# EAGLE design sx-wdec-smd-4313 (EAGLE 7.7.0)
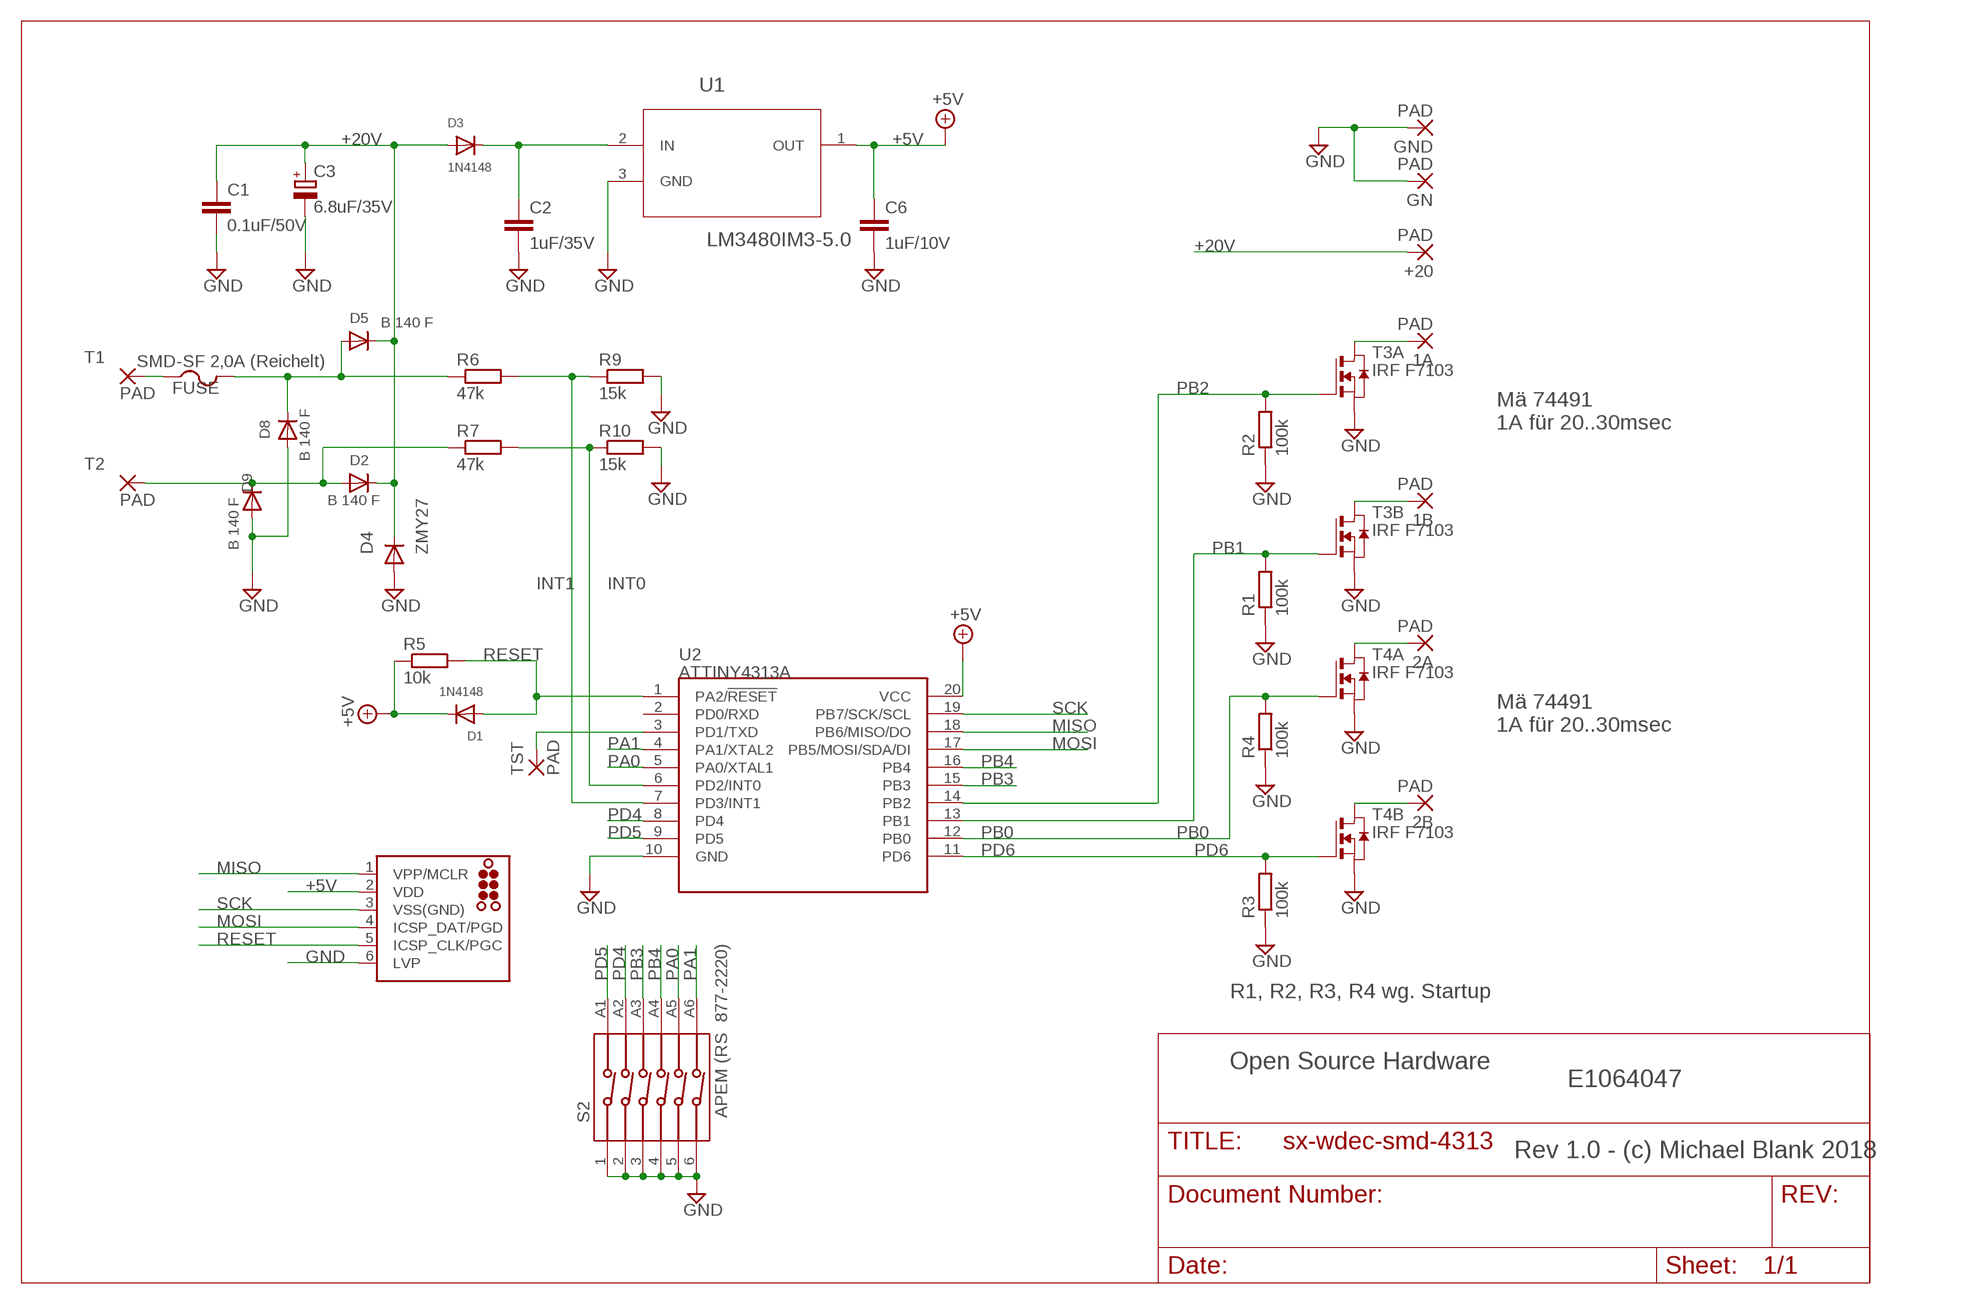
[diagram p0: schematic, sheet 1]

## Parts
1A  PAD  SMD2  [SMD1,27-2,54]
1B  PAD  SMD2  [SMD1,27-2,54]
2A  PAD  SMD2  [SMD1,27-2,54]
2B  PAD  SMD2  [SMD1,27-2,54]
+20  PAD  SMD2  [SMD1,27-2,54]
C1  0.1uF/50V  C-EUC0805  [C0805]
C2  1uF/35V  C-EUC0805  [C0805]
C3  6.8uF/35V  CPOL-EUSMCD  [SMC_D]
C6  1uF/10V  C-EUC0805  [C0805]
D1  1N4148  DIODESOD-323F  [SOD-323F]
D2  B 140 F  DIODESMA-403D  [SMA-403D]
D3  1N4148  DIODESOD-323F  [SOD-323F]
D4  ZMY27  DIODE-MELF-MLL41  [MELF-MLL41]
D5  B 140 F  DIODESMA-403D  [SMA-403D]
D8  B 140 F  DIODESMA-403D  [SMA-403D]
D9  B 140 F  DIODESMA-403D  [SMA-403D]
FUSE  SMD-SF 2,0A (Reichelt)  PTCFUSE-1812  [1812]
GN  PAD  SMD2  [SMD1,27-2,54]
GND  PAD  SMD2  [SMD1,27-2,54]
J1  ISP  TC2030-MCP-NL  [TC2030-MCP-NL]
R1  100k  R-EU_R0805W  [R0805W]
R2  100k  R-EU_R0805W  [R0805W]
R3  100k  R-EU_R0805W  [R0805W]
R4  100k  R-EU_R0805W  [R0805W]
R5  10k  R-EU_R0805W  [R0805W]
R6  47k  R-EU_R0805W  [R0805W]
R7  47k  R-EU_R0805W  [R0805W]
R9  15k  R-EU_R0805W  [R0805W]
R10  15k  R-EU_R0805W  [R0805W]
S2  APEM (RS 877-2220)  416131160806  [416131160806]
T1  PAD  SMD2  [SMD1,27-2,54]
T2  PAD  SMD2  [SMD1,27-2,54]
T3  IRF F7103  DMN3024LSD  [SO8]
T4  IRF F7103  DMN3024LSD  [SO8]
TST  PAD  SMD2  [SMD1,27-2,54]
U1  LM3480IM3-5.0  [SOT95P263X110-3N]
U2  ATTINY4313A  ATTINY2313A  [SOP20W]

## Nets
+5V: C6.1 D1.C J1.2(VDD) R5.1 U1.1(OUT) U2.20(VCC)
+20V: +20.1(P) C1.1 C3.+ D2.C D3.A D4.C D5.C
GND: C1.2 C2.2 C3.- C6.2 D4.A D8.A D9.A GN.1(P) GND.1(P) J1.6(LVP) R1.1 R2.1 R3.1 R4.1 R9.2 R10.2 S2.1 S2.2 S2.3 S2.4 S2.5 S2.6 T3.1(A:S) T3.3(B:S) T4.1(A:S) T4.3(B:S) U1.3(GND) U2.10(GND)
INT0: R7.2 R10.1 U2.6(PD2/INT0)
INT1: R6.2 R9.1 U2.7(PD3/INT1)
MISO: J1.1(VPP/MCLR) U2.18(PB6/MISO/DO)
MOSI: J1.4(ICSP_DAT/PGD) U2.17(PB5/MOSI/SDA/DI)
N$1: 2B.1(P) T4.5(B:D) T4.6(B:D)
N$2: 2A.1(P) T4.7(A:D) T4.8(A:D)
N$3: FUSE.1 T1.1(P)
N$5: D5.A D8.C FUSE.2 R6.1
N$6: TST.1(P) U2.3(PD1/TXD)
N$7: C2.1 D3.C U1.2(IN)
N$8: 1B.1(P) T3.5(B:D) T3.6(B:D)
N$10: 1A.1(P) T3.7(A:D) T3.8(A:D)
PA0: S2.A5 U2.5(PA0/XTAL1)
PA1: S2.A6 U2.4(PA1/XTAL2)
PB0: R4.2 T4.2(A:G) U2.12(PB0)
PB1: R1.2 T3.4(B:G) U2.13(PB1)
PB2: R2.2 T3.2(A:G) U2.14(PB2)
PB3: S2.A3 U2.15(PB3)
PB4: S2.A4 U2.16(PB4)
PD4: S2.A2 U2.8(PD4)
PD5: S2.A1 U2.9(PD5)
PD6: R3.2 T4.4(B:G) U2.11(PD6)
RESET: D1.A J1.5(ICSP_CLK/PGC) R5.2 U2.1(PA2/!RESET)
SCK: J1.3(VSS(GND)) U2.19(PB7/SCK/SCL)
TR-L: D2.A D9.C R7.1 T2.1(P)
Unconnected: U2.2(PD0/RXD)

## Notes on the sheet
- Mä 74491
  1A für 20..30msec
- Mä 74491
  1A für 20..30msec
- R1, R2, R3, R4 wg. Startup
- Open Source Hardware
- E1064047
- Rev 1.0 - (c) Michael Blank 2018

## Library data of the parts
1A 1B 2A 2B +20 GN GND T1 T2 TST = wirepad:SMD2: SMD PAD
C1 C2 C6 = rcl:C-EU: CAPACITOR, European symbol
C3 = resistor:CPOL-EU: POLARIZED CAPACITOR, European symbol
D1 D3 = adafruit:DIODE: Diode SMADIODE - SMA Surface Mount Package 20V 1A Schottky Diode Digikey: 641-1014-6-ND DO-1N4148 - Through Hole Small Current Diode SOD-123 20V 1 A (.5mV Vf) Schottky Diode - Digikey: MBRX120TPMSCT-ND SOD-323 10V 570mA (.38mV Vf, 3ns) Schottky Diode - Digikey: ZLLS410CT-ND SOD-523 30V 30mA Schottky Diode (RB751S-40TE61) - Digikey: RB751S-40TE61CT-ND SOT23-R/W - SOT23 Package (R = Solder Paste/Reflow Ovens, W = Hand-Soldering) BAT54Film 40V 300mA - Digikey: 497-7162-1-ND
D2 D5 D8 D9 = Ai_DiscreteSemis:DIODE
D4 = diode:DIODE-: DIODE
FUSE = adafruit:PTCFUSE: PTC fuses, resettable thermistors
J1 = tag-connect:TC2030: TAG-CONNECT ICSP Connector Manufacturer: Tag-Connect <http://www.tag-connect.com> Cable for easy In-Circuit Serial Programming. Designed for Microchip ICD2, suitable for many others. Two variants - one "with legs" (for hands-free fit on PCB) and another "without legs" for quick programming. PAD Description 1 MCLR/Vpp 2 Vdd 3 GND 4 PGD (ISPDAT) 5 PGC (ISPCLK) 6 nc (used for LVP) ©2009 ROFA.cz - modified and updated by Robert Darlington ‹rdarlington@gmail.com›
R1-R7 R9 R10 = rcl:R-EU_: RESISTOR, European symbol
S2 = Eagle_SWITCHES_wuerth:416131160806: WS-DISV 1.27mm small compact SMD flat actuator with top tape Specification MATERIAL PROPERTIES: Cover Material PPA Cover Flammability Rating UL94 V-0 Cover Color Brown Base Material PPA Base Flammability Rating UL94 V-0 Base Color Brown Actuator Material PA46 Actuator Flammability Rating UL94 V-0 Actuator Color White Contact Plating Gold Terminal Plating Gold ELECTRICAL PROPERTIES: Rated Current Switching 25 mA Rated Current Non-Switching 100 mA Contact Resistance Initial 100 mΩ Contact Resistance After Life Test 200 mΩ Insulation Resistance 100 MΩ Withstanding Voltage 300 V (AC) MECHANICAL PROPERTIES: Operation Force 500 g Electrical Life 1000 Cycles Mechanical Life min. 2000 cycles Actuator Type Flat Type Switch Position Off <http://katalog.we-online.de/media/images/v2/Family_WS-DISV_SMD_FLAT_ACTUATOR_4161311608xx_4C.jpg> Details see: http://katalog.we-online.de/en/em/DISV_1_27_SMALL_COMPACT_SMD_FLAT_ACTUATOR/416131160806 2015 (C) Wurth Elektronik
T3 T4 = zetex:DMN3024LSD: 30V DUAL N-CHANNEL ENHANCEMENT MODE MOSFET Source: Data sheet <http://www.diodes.com/datasheets/DMN3024LSD.pdf>; OC_FARNELL: unknown; OC_NEWARK: unknown
U1 = lm3480:LM3480IM3-5.0: Linear Voltage Regulator; MPN: LM3480IM3-50; OC_FARNELL: 3160634; OC_NEWARK: 83F3816; PACKAGE: SOT-23-3; SUPPLIER: National Semiconductors
U2 = SparkFun-IC-Microcontroller:ATTINY2313A: ATTINY2313A 2kB 20MHz I2C/SPI/UART Datasheet <https://cdn.sparkfun.com/datasheets/Widgets/ATtiny2313A.pdf> SparkFun Products SparkFun Wake on Shake <https://www.sparkfun.com/products/11447> (SEN-11447); PROD_ID: IC-11305; VALUE: ATTINY2313A

## Board
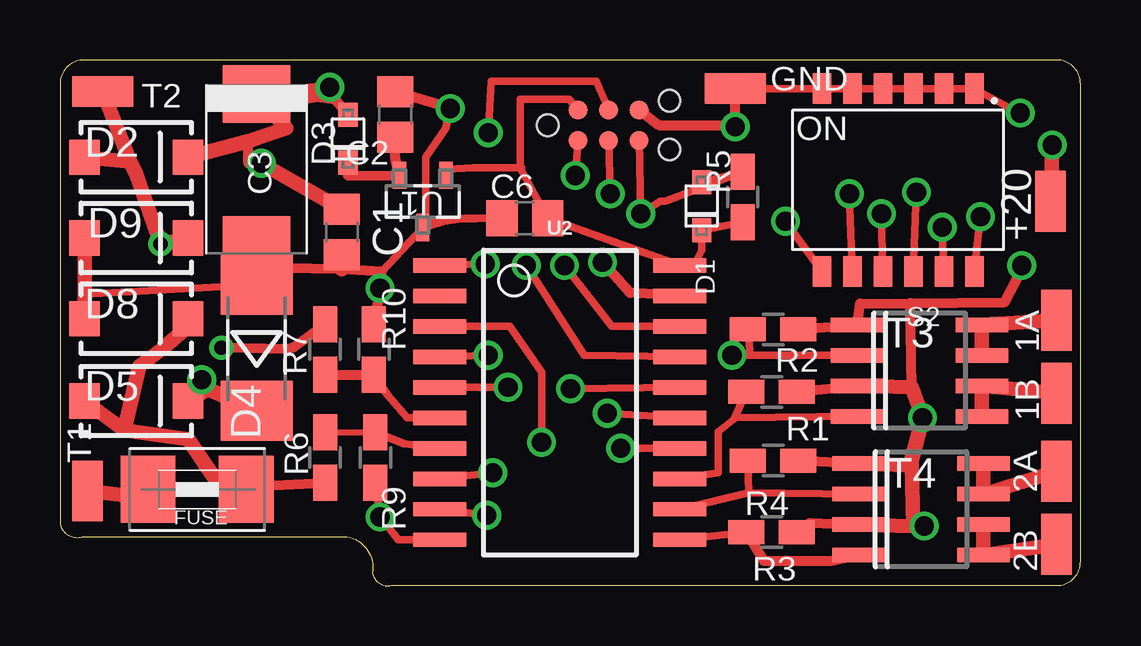
[diagram p1: board, top side]
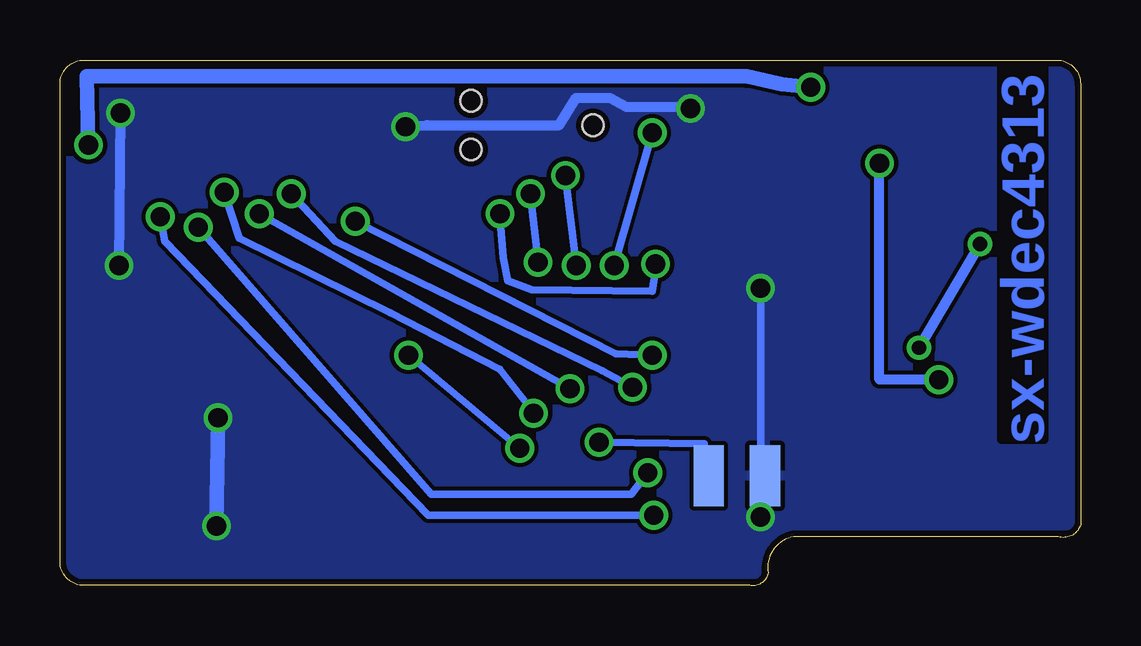
[diagram p2: board, bottom side, seen from below]

Size 42.52 x 21.91 mm. Coordinates in mm from the lower left corner, seen from the top.
Outline: 13.02,0.54 arc90 13.8,0.01 41.52,0.01 arc90 42.52,1.01 42.52,20.91 arc90 41.52,21.91 1,21.91 arc90 0,20.91 0,2.54 arc90 0.94,2.04 11.95,2.04 arc-90 13.02,0.54
Copper layers (1*16): Top 0.035mm / dielectric 1.55mm / Bottom 0.035mm
Design rules "eC_2Layer_PClass6_BaseCopperO35": minimum track width 0.15mm, minimum drill 0.35mm, track to track 0.175mm, track to pad 0.175mm, pad to pad 0.175mm, via to via 0.175mm, smd to smd 0mil, copper to edge 0.25mm, drill to drill 0.35mm, minimum pad ring 0.175mm, minimum via ring 0.125mm, stop-mask expansion 0mil, vias tented up to drill 0.45mm, thermal gap 0.2mm

### Footprints (pad centres in the part's own frame; a part is rotated, then mirrored left to right if it is on the bottom)
SMD1,27-2,54 = smd 1.27 x 2.54: 1 0,0
C0805 = smd 1.3 x 1.5: 1 -0.95,0; 2 0.95,0
SMC_D = smd 2.4 x 2.8: + -3.15,0; - 3.15,0
SOD-323F = smd 1 x 0.8: A -1,0; C 1,0
SMA-403D = smd 1.27 x 1.47: A -2.15,0; C 2.15,0
MELF-MLL41 = smd 2.5 x 3: A 2.625,0; C -2.625,0
1812 = smd 2.286 x 2.794: 1 -2.046,0; 2 2.046,0
TC2030-MCP-NL = smd 0.787 x 0.787: 1 1.27,-0.635; 2 1.27,0.635; 3 2.54,-0.635; 4 2.54,0.635; 5 3.81,-0.635; 6 3.81,0.635 | hole 0.889: 0,0; 5.08,-1.016; 5.08,1.016
R0805W = smd 1.5 x 1: 1 -1.052,0; 2 1.052,0
416131160806 = smd 0.76 x 1.27: 1 -3.175,-3.81; 2 -1.905,-3.81; 3 -0.635,-3.81; 4 0.635,-3.81; 5 1.905,-3.81; 6 3.175,-3.81; A1 -3.175,3.81; A2 -1.905,3.81; A3 -0.635,3.81; A4 0.635,3.81; A5 1.905,3.81; A6 3.175,3.81
SO8 = smd 0.6 x 2.2: 1 -1.905,-2.6; 2 -0.635,-2.6; 3 0.635,-2.6; 4 1.905,-2.6; 5 1.905,2.6; 6 0.635,2.6; 7 -0.635,2.6; 8 -1.905,2.6
SOT95P263X110-3N = smd 0.559 x 1.143: 1 -0.965,-1.092; 2 0.965,-1.092; 3 0,1.092
SOP20W = smd 0.6 x 2.2: 1 -5.715,-5; 2 -4.445,-5; 3 -3.175,-5; 4 -1.905,-5; 5 -0.635,-5; 6 0.635,-5; 7 1.905,-5; 8 3.175,-5; 9 4.445,-5; 10 5.715,-5; 11 5.715,5; 12 4.445,5; 13 3.175,5; 14 1.905,5; 15 0.635,5; 16 -0.635,5; 17 -1.905,5; 18 -3.175,5; 19 -4.445,5; 20 -5.715,5

### Placement (x,y rotation side)
1A  41.53,11.06 180 top
1B  41.53,8.01 180 top
2A  41.53,4.77 0 top
2B  41.53,1.73 0 top
+20  41.27,16.01 0 top
C1  11.75,14.74 270 top
C2  13.97,19.63 90 top
C3  8.19,17.35 270 top
C6  19.37,15.32 180 top
D1  26.73,15.82 270 top
D2  3.18,17.86 0 top
D3  12,18.62 270 top
D4  8.19,9.92 90 top
D5  3.18,7.7 0 top
D8  3.18,11.12 0 top
D9  3.18,14.49 0 top
FUSE  5.71,4.01 0 top
GN  13.14,4.58 0 bottom
GND  28.13,20.71 270 top
J1  20.32,19.19 0 top
R1  29.65,8.08 180 top
R2  29.72,10.68 180 top
R3  29.65,2.23 180 top
R4  29.72,5.22 180 top
R5  28.45,16.2 90 top
R6  11.05,5.35 90 top
R7  11.05,9.85 270 top
R9  13.14,5.35 270 top
R10  13.08,9.85 90 top
S2  34.92,16.9 180 top
T1  1.14,3.95 180 top
T2  1.78,20.59 90 top
T3  35.81,8.97 270 top
T4  35.88,3.19 270 top
TST  15.49,4.58 0 bottom
U1  15.11,16.01 180 top
U2  20.83,7.63 270 top

### Tracks (layer width: path | path; a pad name or v marks a point on that pad's centre or on a via)
+5V
  Top 0.305: R5.1 D1.C 26.73,13.98 26.48,13.47 U2.20 C6.1 19.17,17.4 | J1.2 21.21,20.27 19.18,20.27 19.17,17.4 | 19.17,17.4 19.24,17.41 17.21,17.41 16.13,17.36 U1.1
+20V  (via drill 0.8)
  Top 0.406: v8.38,17.6 7.85,17.6 7.85,18.52 | D3.A 11.49,20.25 10.03,20.43 | v11.24,20.78 10.42,20.52
  Top 0.61: D2.C 7.85,18.52 9.42,19.06 C3.+ | D4.C 6.17,8.18 | 6.17,8.18 D5.C | v41.34,18.36 41.34,18.17 +20.1 | 6.17,8.18 5.91,8.18 v5.91,8.58 | C1.1 v8.38,17.6
  Top 0.813: C3.+ 10.03,20.43 10.42,20.52 10.79,20.56
  Bottom 0.406: v5.91,8.58 8.38,8.58 v8.38,17.6
  Bottom 0.61: v11.24,20.78 12.45,20.9 13.91,21.22 41.4,21.22 v41.34,18.36
GND  (via drill 0.8)
  Top 0.305: 13.4,13.09 U1.3 16,15.19 16.89,15.32 C6.2 15.24,15.25 15.24,17.86 16.07,19.06 v16.26,19.89 | C3.- D4.A 1.02,12.14 | U2.10 14.1,1.92 v13.34,2.87 R9.2 | v13.34,12.39 13.32,12.14 | GND.1 S2.6 S2.5 S2.4 S2.3 S2.2 S2.1 40,19.67
  Top 0.406: R3.1 30.86,2.36 31.24,2.62 T4.3 | T4.1 R4.1 | 35.43,11.78 33.34,11.76 T3.1 R2.1 | 35.43,11.78 39.37,11.82 40.13,13.28 v40.07,13.35 | R1.1 T3.3 | 40.11,19.61 39.94,19.7 | 39.94,19.7 v40,19.7 | 40,19.67 39.94,19.7 | R10.2 13.32,12.14 13.4,13.09 11.74,13.2 9.21,13.22 9.27,13.22 | 28.13,19.19 GND.1 | J1.6 24.96,19.19 28.13,19.19 | 28.13,19.19 v28.13,19.13 | v16.26,19.89 C2.2 | 35.5,8.27 35.43,11.78
  Top 0.61: D8.A 1.02,12.14 D9.A | T3.3 35.5,8.27 v35.94,7 35.43,5.03 T4.1 | T4.3 35.56,2.49 | 35.56,2.49 35.5,5.09 | v36,2.49 35.56,2.49 | C3.- 9.21,13.22 | C1.2 11.74,13.2
  Bottom 0.305: v13.34,12.39 v13.34,2.87 GN.1
  Bottom 0.406: v40,19.7 v40.07,13.35 | v28.13,19.13 27.24,19.19 21.72,19.19 21.02,20.33 19.62,20.33 18.92,19.95 16.64,19.95 v16.26,19.89
  Bottom 0.61: v35.94,7 v36,2.49
  pour Bottom: 0.25,21.6 0.25,2.11 12.57,2.11 12.7,0.2 42.42,0.2 42.23,21.6
INT0
  Top 0.305: U2.6 14.48,7 13.53,8.08 13.65,7.95 R10.1
  Top 0.406: R7.2 R10.1
INT1
  Top 0.254: R6.2 R9.1
  Top 0.305: U2.7 14.35,5.92 R9.1
MISO  (via drill 0.8)
  Top 0.305: J1.1 v21.46,17.09 | v21.02,13.35 22.99,10.81 U2.18
  Bottom 0.305: v21.46,17.09 v21.02,13.35
MOSI  (via drill 0.8)
  Top 0.305: U2.17 21.84,9.6 v19.43,13.35 | v17.84,18.87 17.97,21.03 22.35,21.03 J1.4
  Bottom 0.305: v19.43,13.35 v17.84,18.87
N$1
  Top 0.61: 2B.1 T4.5 T4.6
N$2
  Top 0.61: 2A.1 T4.7 T4.8
N$3
  Top 0.61: T1.1 2.84,3.76 FUSE.1
N$5
  Top 0.406: FUSE.2 8,4.14 R6.1
  Top 0.61: FUSE.2 6.43,4.51 5.33,6.11 2.67,6.49 | 2.67,6.49 D5.A | D8.C 5.21,10.68 4.32,9.92 3.3,9.16 2.67,6.49
N$6  (via drill 0.8)
  Top 0.305: v20.07,5.98 20.07,8.9 18.73,10.81 U2.3
  Bottom 0.305: TST.1 15.56,4.01 15.56,4.08 | 15.56,4.14 15.56,4.08 | 15.56,4.08 15.68,5.92 v20.07,5.98
N$7
  Top 0.406: D3.C 12,17.09 U1.2 13.97,17.79 C2.1
N$8
  Top 0.61: 1B.1 T3.6 T3.5
N$10
  Top 0.61: T3.7 T3.8 1A.1
PA0  (via drill 0.8)
  Top 0.305: U2.5 v18.67,8.27 | v32.89,16.33 S2.A5
  Bottom 0.305: v18.67,8.27 19.94,8.97 31.05,14.36 v32.89,16.33
PA1  (via drill 0.8)
  Top 0.305: S2.A6 v30.23,15.19 | v17.84,9.6 U2.4
  Bottom 0.305: v30.23,15.19 19.37,9.66 v17.84,9.6
PB0
  Top 0.305: T4.2 28.7,3.89 | 28.7,3.89 R4.2 | U2.12 28.7,3.89
PB1
  Top 0.305: U2.13 27.43,4.71 27.43,6.43 28.07,6.93 R1.2 28.13,7 T3.4
PB2  (via drill 0.8)
  Top 0.305: R2.2 28.77,9.6 | 28.77,9.6 T3.2 | 28.77,9.6 v28,9.6 | v23.37,5.73 U2.14
  Bottom 0.305: v28,9.6 v23.37,5.73
PB3  (via drill 0.8)
  Top 0.305: U2.15 v22.8,7.19 | v35.69,16.4 S2.A3
  Bottom 0.305: v22.8,7.19 22.8,7.25 24.19,9.03 28.77,11.38 35.05,14.49 v35.69,16.4
PB4  (via drill 0.8)
  Top 0.305: S2.A4 v34.23,15.51 | v21.27,8.2 U2.16
  Bottom 0.305: v34.23,15.51 v21.27,8.2
PD4  (via drill 0.8)
  Top 0.305: S2.A2 v36.77,14.94 | v18.03,4.71 U2.8
  Bottom 0.305: v36.77,14.94 27.05,3.82 18.73,3.82 v18.03,4.71
PD5  (via drill 0.8)
  Top 0.305: U2.9 v17.78,2.93 | v38.35,15.38 S2.A1
  Bottom 0.305: v17.78,2.93 27.18,2.93 38.16,14.36 v38.35,15.38
PD6
  Top 0.305: U2.11 R3.2
  Top 0.406: T4.4 32.13,1.03 29.34,1.03 R3.2
RESET  (via drill 0.8)
  Top 0.305: D1.A R5.2 25.21,16.01 25.02,16.01 v24.19,15.51 J1.5 | U2.1 v17.72,13.41
  Bottom 0.305: v17.72,13.41 17.72,13.09 17.84,12.27 22.86,12.33 23.88,12.71 24.07,13.66 24.19,15.44 v24.19,15.51
SCK  (via drill 0.8)
  Top 0.305: v22.92,16.33 J1.3
  Top 0.406: U2.19 23.75,12.2 v22.61,13.47
  Bottom 0.305: v22.61,13.47 v22.92,16.33
TR-L  (via drill 0.6 pad 1.02)
  Top 0.406: R7.1 9.72,9.92 9.46,9.86 v6.73,9.92
  Top 0.61: T2.1 2.93,17.67 | 2.93,17.67 D2.A | 2.93,17.67 3.18,17.16 v4.19,14.24 D9.C
  Bottom 0.406: v6.73,9.92 v4.19,14.24

### Text on the board
Bottom: sx-wdec4313
tNames: ON
tDocu: DIP Schalter: | BIT=1+ / 1 2 4 | ADR=84+ / 1 2 4